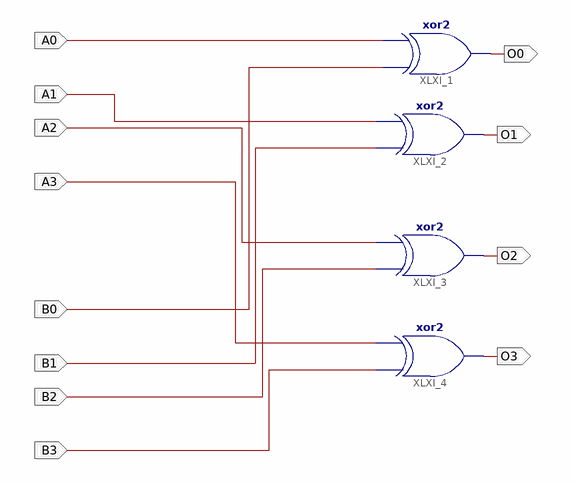
[diagram p0: schematic sheet 1]
// Xilinx ISE schematic Xor4Bit.sch (xc9500xl) as structural Verilog: 4 symbols, 12 ports
module Xor4Bit (
  input  A0,
  input  A1,
  input  A2,
  input  A3,
  input  B0,
  input  B1,
  input  B2,
  input  B3,
  output O0,
  output O1,
  output O2,
  output O3
);

  xor XLXI_1 (O0, B0, A0);
  xor XLXI_2 (O1, B1, A1);
  xor XLXI_3 (O2, B2, A2);
  xor XLXI_4 (O3, B3, A3);
endmodule
